# Altium schematic sheet Earphone-3.SchDoc
size A4
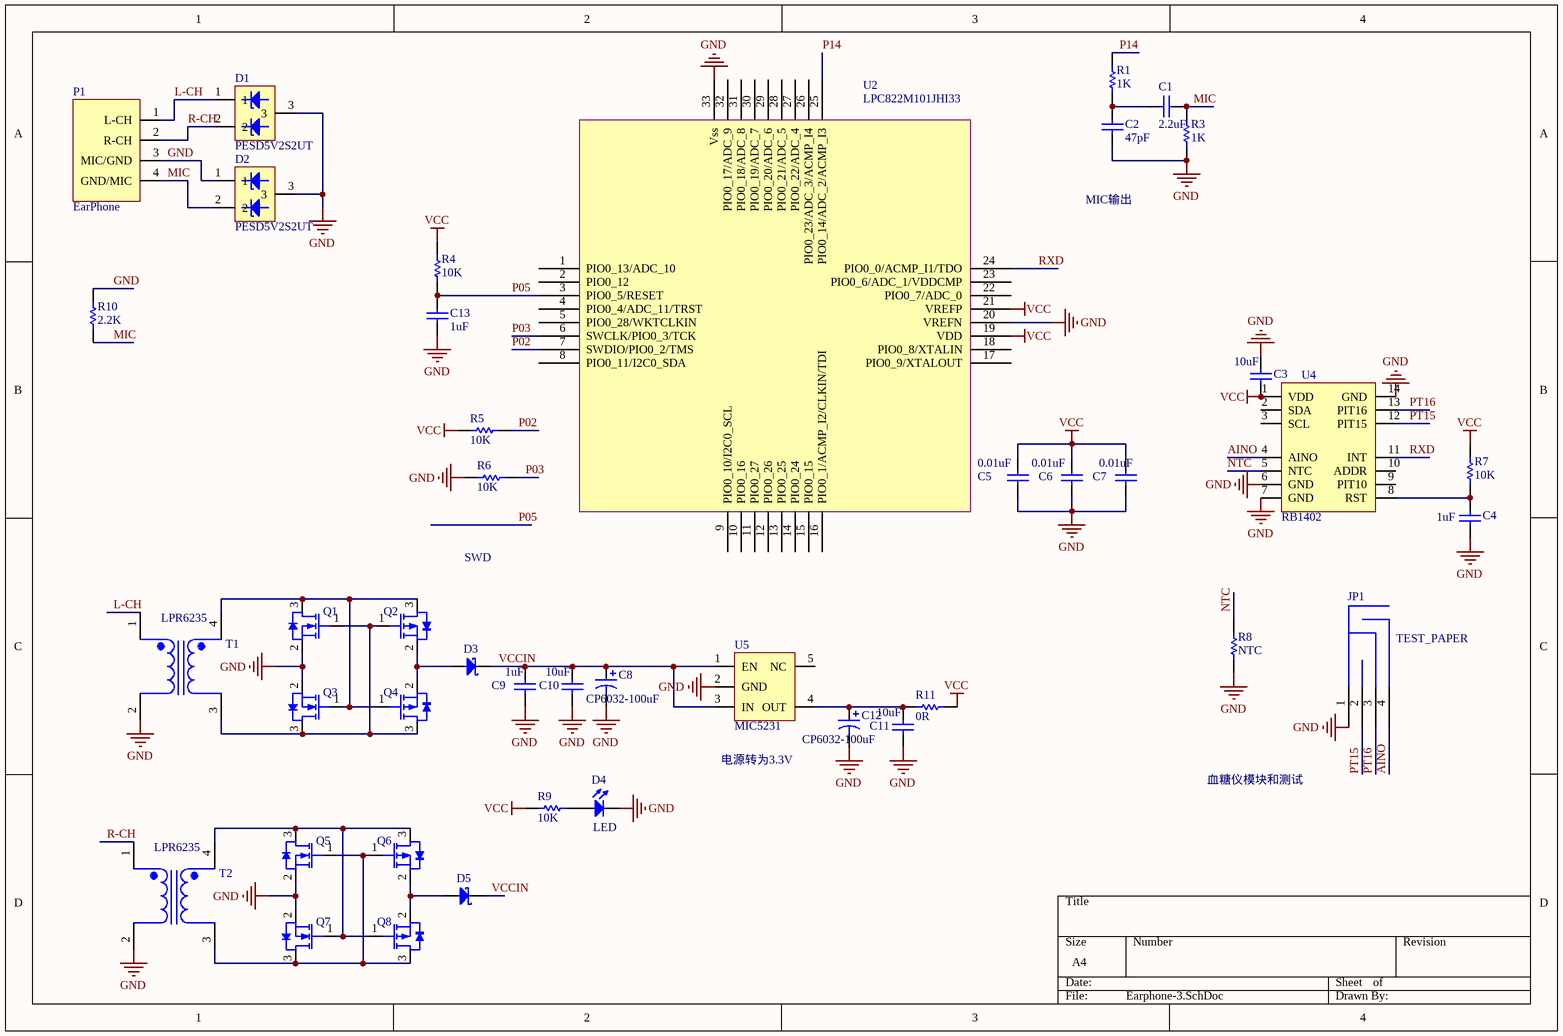
[diagram p0: Earphone-3.SchDoc]

## Parts
C1  2.2uF  [0402C]
C2  47pF  [0402C]
C3  10uF  [0402C]
C4  1uF  [0402C]
C5  0.01uF  [0402C]
C6  0.01uF  [0402C]
C7  0.01uF  [0402C]
C8  CP6032-100uF  [T3216-18[A]]
C9  1uF  [0402C]
C10  10uF  [0402C]
C11  10uF  [0402C]
C12  CP6032-100uF  [T3216-18[A]]
C13  1uF  [0402C]
D1  PESD5V2S2UT  [SOT23]
D2  PESD5V2S2UT  [SOT23]
D3  PMEG4002EJ  [SOD323]  (value not drawn)
D4  LED  [0603L]
D5  PMEG4002EJ  [SOD323]  (value not drawn)
JP1  TEST_PAPER  [TEST_PAPER]
P1  EarPhone  [USB-A]
Q1  N-MOSFET  [SOT23]  (value not drawn)
Q2  P-MOSFET  [SOT23]  (value not drawn)
Q3  N-MOSFET  [SOT23]  (value not drawn)
Q4  P-MOSFET  [SOT23]  (value not drawn)
Q5  N-MOSFET  [SOT23]  (value not drawn)
Q6  P-MOSFET  [SOT23]  (value not drawn)
Q7  N-MOSFET  [SOT23]  (value not drawn)
Q8  P-MOSFET  [SOT23]  (value not drawn)
R1  1K  [0402R]
R3  1K  [0402R]
R4  10K  [0402R]
R5  10K  [0402R]
R6  10K  [0402R]
R7  10K  [0402R]
R8  NTC  [0603R]
R9  10K  [0402R]
R10  2.2K  [0402R]
R11  0R  [0402R]
T1  LPR6235  [Trans EMI]
T2  LPR6235  [Trans EMI]
U2  LPC822M101JHI33  [QFN50P500X500X100-33N]
U4  RB1402  [RB1402]
U5  MIC5231  [SOT23-5]

## Nets
GND: C2.1 C3.2 C4.1 C5.1 C6.1 C7.1 C8.2 C9.1 C10.1 C11.1 C12.2 C13.1 D1.3 D2.1 D2.3 D4.2(K) JP1.1(N) P1.3(MIC/GND) Q1.2(S) Q3.2(S) Q5.2(S) Q7.2(S) R3.2 R6.2 R8.1 R10.2 T1.2 T2.2 U2.20(VREFN) U2.33(Vss) U4.6(GND) U4.7(GND) U4.14(GND) U5.2(GND)
VCC: C3.1 C5.2 C6.2 C7.2 R4.2 R5.1 R7.2 R9.1 R11.2 U2.19(VDD) U2.21(VREFP) U4.1(VDD)
AINO: JP1.4(P) U4.4(AINO)
L-CH: D1.1 P1.1(L-CH) T1.1
MIC: C1.1 D2.2 P1.4(GND/MIC) R3.1 R10.1
NTC: R8.2 U4.5(NTC)
P02: R5.2 U2.7(SWDIO/PIO0_2/TMS)
P03: R6.1 U2.6(SWCLK/PIO0_3/TCK)
P05: C13.2 R4.1 U2.3(PIO0_5/RESET)
P14: R1.1 U2.25(PIO0_14/ADC_2/ACMP_I3)
PT15: JP1.2(PC10) U4.12(PIT15)
PT16: JP1.3(NOP) U4.13(PIT16)
R-CH: D1.2 P1.2(R-CH) T2.1
RXD: U2.24(PIO0_0/ACMP_I1/TDO) U4.11(INT)
VCCIN: C8.1 C9.2 C10.2 D3.1 D5.1 U5.1(EN) U5.3(IN)
NetC1_2: C1.2 C2.2 R1.2
NetC4_2: C4.2 R7.1 U4.8(RST)
NetC11_2: C11.2 C12.1 R11.1 U5.4(OUT)
NetD3_2: D3.2 Q2.2(S) Q4.2(S)
NetD4_1: D4.1(A) R9.2
NetD5_2: D5.2 Q6.2(S) Q8.2(S)
NetQ1_1: Q1.1(G) Q2.1(G) Q3.3(D) Q4.3(D) T1.3
NetQ1_3: Q1.3(D) Q2.3(D) Q3.1(G) Q4.1(G) T1.4
NetQ5_1: Q5.1(G) Q6.1(G) Q7.3(D) Q8.3(D) T2.3
NetQ5_3: Q5.3(D) Q6.3(D) Q7.1(G) Q8.1(G) T2.4

Not connected (* = marked no-connect by the designer): U2 1(PIO0_13/ADC_10) 2(PIO0_12) 4(PIO0_4/ADC_11/TRST) 5(PIO0_28/WKTCLKIN) 8(PIO0_11/I2C0_SDA) 9(PIO0_10/I2C0_SCL) 10(PIO0_16) 11(PIO0_27) 12(PIO0_26) 13(PIO0_25) 14(PIO0_24) 15(PIO0_15) 16(PIO0_1/ACMP_I2/CLKIN/TDI) 17(PIO0_9/XTALOUT) 18(PIO0_8/XTALIN) 22(PIO0_7/ADC_0) 23(PIO0_6/ADC_1/VDDCMP) 26(PIO0_23/ADC_3/ACMP_I4) 27(PIO0_22/ADC_4) 28(PIO0_21/ADC_5) 29(PIO0_20/ADC_6) 30(PIO0_19/ADC_7) 31(PIO0_18/ADC_8) 32(PIO0_17/ADC_9); U4 2(SDA) 3(SCL) 9(PIT10) 10(ADDR); U5 5(NC)

## Notes on the sheet
- MIC输出
- SWD
- (near U5) 电源转为3.3V
- 血糖仪模块和测试

## Library data of the parts
C1-C7 C9-C11 C13 = CAP
C8 C12 = CAP POL2
D1 D2 = PESD5V2S2UT: SOT23
D3 D5 = PMEG4002EJ: SOD323F
Q1 Q3 Q5 Q7 = N-MOSFET: 4N80 N-Channel MOSFET
Q2 Q4 Q6 Q8 = P-MOSFET: P-Channel MOSFET
R1 R3-R11 = RES
T1 T2 = Trans EMI